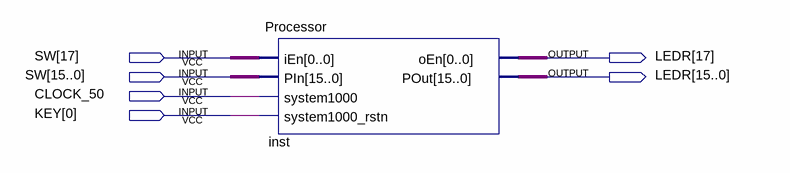
[diagram p0: schematic sheet]
// Quartus schematic fib_led.bdf as structural Verilog: 1 symbols, 6 pins
module fib_led (
  input  [17:0] SW,
  input  CLOCK_50,
  input  [0:0] KEY,
  output [17:0] LEDR
);

  Processor inst (
    .iEn(SW[17]), .PIn(SW[15:0]), .system1000(CLOCK_50), .system1000_rstn(KEY[0]), .oEn(LEDR[17]),
    .POut(LEDR[15:0]));
endmodule
